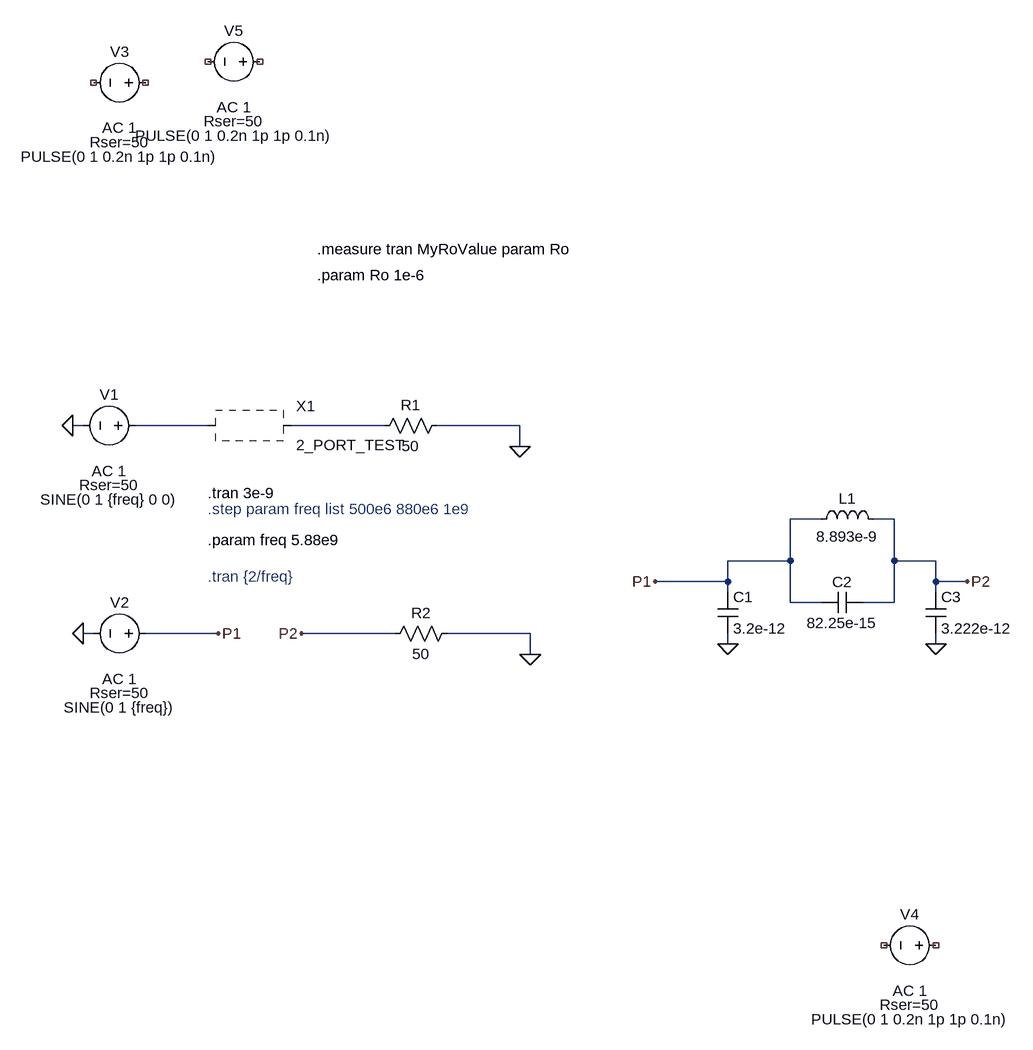
[diagram p0: schematic test_tran.asc]
test_tran.asc, the LTspice schematic file:
Version 4
SHEET 1 2664 1276
WIRE 64 352 48 352
WIRE 256 352 144 352
WIRE 528 352 384 352
WIRE 736 352 608 352
WIRE 736 384 736 352
WIRE 1200 496 1152 496
WIRE 1312 496 1280 496
WIRE 1152 560 1152 496
WIRE 1152 560 1056 560
WIRE 1312 560 1312 496
WIRE 1376 560 1312 560
WIRE 1056 592 1056 560
WIRE 1056 592 944 592
WIRE 1376 592 1376 560
WIRE 1424 592 1376 592
WIRE 1056 608 1056 592
WIRE 1376 608 1376 592
WIRE 1152 624 1152 560
WIRE 1200 624 1152 624
WIRE 1312 624 1312 560
WIRE 1312 624 1264 624
WIRE 80 672 64 672
WIRE 272 672 160 672
WIRE 544 672 400 672
WIRE 752 672 624 672
WIRE 1056 688 1056 672
WIRE 1376 688 1376 672
WIRE 752 704 752 672
FLAG 736 384 0
FLAG 48 352 0
FLAG 752 704 0
FLAG 64 672 0
FLAG 272 672 P1
FLAG 400 672 P2
FLAG 944 592 P1
FLAG 1424 592 P2
FLAG 1376 688 0
FLAG 1056 688 0
SYMBOL 2_PORT_TEST 320 352 R0
SYMATTR InstName X1
SYMBOL Res 624 336 R90
WINDOW 0 0 56 VBottom 2
WINDOW 3 32 56 VTop 2
SYMATTR InstName R1
SYMATTR Value 50
SYMBOL Voltage 160 352 R90
WINDOW 0 -32 56 VBottom 2
WINDOW 3 98 56 VTop 2
WINDOW 123 54 56 VTop 2
WINDOW 39 76 56 VTop 2
SYMATTR InstName V1
SYMATTR Value SINE(0 1 {freq} 0 0)
SYMATTR Value2 AC 1
SYMATTR SpiceLine Rser=50
SYMBOL Res 640 656 R90
WINDOW 0 0 56 VBottom 2
WINDOW 3 32 56 VTop 2
SYMATTR InstName R2
SYMATTR Value 50
SYMBOL Voltage 176 672 R90
WINDOW 0 -32 56 VBottom 2
WINDOW 3 98 56 VTop 2
WINDOW 123 54 56 VTop 2
WINDOW 39 76 56 VTop 2
SYMATTR InstName V2
SYMATTR Value SINE(0 1 {freq})
SYMATTR Value2 AC 1
SYMATTR SpiceLine Rser=50
SYMBOL Cap 1040 608 R0
SYMATTR InstName C1
SYMATTR Value 3.2e-12
SYMBOL Cap 1264 608 R90
WINDOW 0 0 32 VBottom 2
WINDOW 3 32 32 VTop 2
SYMATTR InstName C2
SYMATTR Value 82.25e-15
SYMBOL Cap 1360 608 R0
SYMATTR InstName C3
SYMATTR Value 3.222e-12
SYMBOL ind 1184 512 R270
WINDOW 0 32 56 VTop 2
WINDOW 3 5 56 VBottom 2
SYMATTR InstName L1
SYMATTR Value 8.893e-9
SYMBOL Voltage 176 -176 R90
WINDOW 0 -32 56 VBottom 2
WINDOW 3 98 56 VTop 2
WINDOW 123 54 56 VTop 2
WINDOW 39 76 56 VTop 2
SYMATTR InstName V3
SYMATTR Value PULSE(0 1 0.2n 1p 1p 0.1n)
SYMATTR Value2 AC 1
SYMATTR SpiceLine Rser=50
SYMBOL Voltage 1392 1152 R90
WINDOW 0 -32 56 VBottom 2
WINDOW 3 98 56 VTop 2
WINDOW 123 54 56 VTop 2
WINDOW 39 76 56 VTop 2
SYMATTR InstName V4
SYMATTR Value PULSE(0 1 0.2n 1p 1p 0.1n)
SYMATTR Value2 AC 1
SYMATTR SpiceLine Rser=50
SYMBOL Voltage 352 -208 R90
WINDOW 0 -32 56 VBottom 2
WINDOW 3 98 56 VTop 2
WINDOW 123 54 56 VTop 2
WINDOW 39 76 56 VTop 2
SYMATTR InstName V5
SYMATTR Value PULSE(0 1 0.2n 1p 1p 0.1n)
SYMATTR Value2 AC 1
SYMATTR SpiceLine Rser=50
TEXT 256 456 Left 2 !.tran 3e-9
TEXT 256 480 Left 2 ;.step param freq list 500e6 880e6 1e9
TEXT 424 80 Left 2 !.measure tran MyRoValue param Ro
TEXT 424 120 Left 2 !.param Ro 1e-6
TEXT 256 528 Left 2 !.param freq 5.88e9
TEXT 256 584 Left 2 ;.tran {2/freq}

The netlist it stands for:
* test_tran.asc
* X1: 2_PORT_TEST (symbol 2_PORT_TEST not available, pin order unknown); nets seen at it: N001, N002
R1 0 N002 50
V1 N001 0 SINE(0 1 {freq} 0 0) AC 1 Rser=50
R2 0 P2 50
V2 P1 0 SINE(0 1 {freq}) AC 1 Rser=50
C1 P1 0 3.2e-12
C2 P2 P1 82.25e-15
C3 P2 0 3.222e-12
L1 P1 P2 8.893e-9
V3 NC_01 NC_02 PULSE(0 1 0.2n 1p 1p 0.1n) AC 1 Rser=50
V4 NC_03 NC_04 PULSE(0 1 0.2n 1p 1p 0.1n) AC 1 Rser=50
V5 NC_05 NC_06 PULSE(0 1 0.2n 1p 1p 0.1n) AC 1 Rser=50
.tran 3e-9
* .step param freq list 500e6 880e6 1e9
.measure tran MyRoValue param Ro
.param Ro 1e-6
.param freq 5.88e9
* .tran {2/freq}
.backanno
.end